# EAGLE design board (EAGLE 6.5.0)
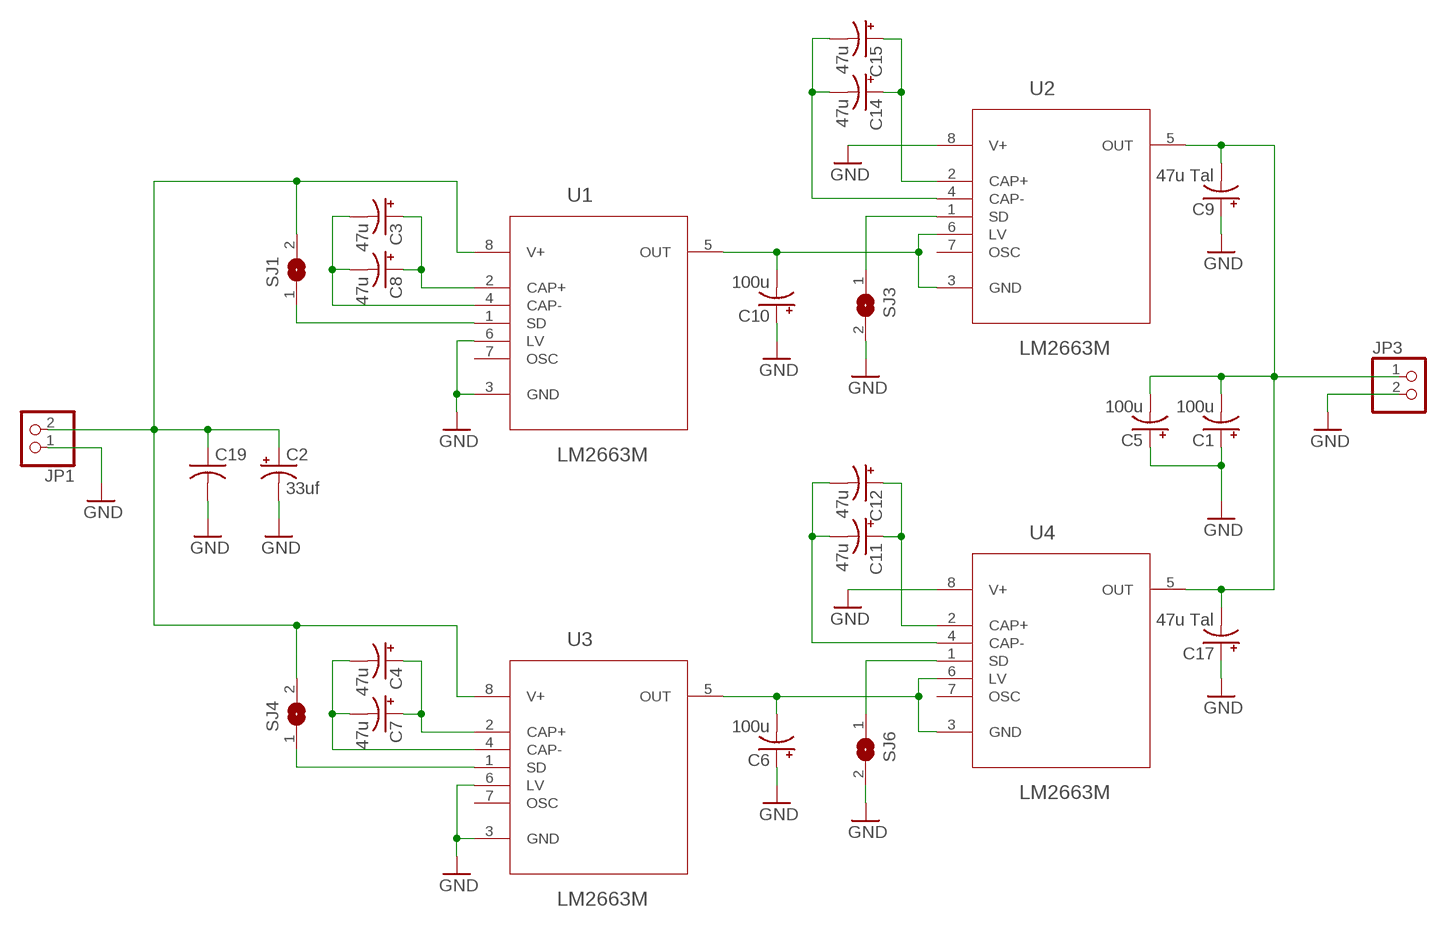
[diagram p0: schematic, sheet 1]

## Parts
C1  100u  CPOL-USE2.5-6  [E2,5-6]
C2  33uf  CPOL-USE2-5  [E2-5]
C3  47u  CAP_POL3528-KIT  [EIA3528-KIT]
C4  47u  CAP_POL3528-KIT  [EIA3528-KIT]
C5  100u  CPOL-USE2.5-6  [E2,5-6]
C6  100u  CAP_POL7343  [EIA7343]
C7  47u  CAP_POL3528-KIT  [EIA3528-KIT]
C8  47u  CAP_POL3528-KIT  [EIA3528-KIT]
C9  47u Tal  CAP_POL6032  [EIA6032]
C10  100u  CAP_POL7343  [EIA7343]
C11  47u  CAP_POL3528-KIT  [EIA3528-KIT]
C12  47u  CAP_POL3528-KIT  [EIA3528-KIT]
C14  47u  CAP_POL3528-KIT  [EIA3528-KIT]
C15  47u  CAP_POL3528-KIT  [EIA3528-KIT]
C17  47u Tal  CAP_POL6032  [EIA6032]
C19  C-USC1206  [C1206]
JP1  PINHD-1X2  [1X02]
JP3  PINHD-1X2  [1X02]
SJ1  SJ  [SJ]
SJ3  SJ  [SJ]
SJ4  SJ  [SJ]
SJ6  SJ  [SJ]
U1  LM2663M  [SOIC127P620X175-8N]
U2  LM2663M  [SOIC127P620X175-8N]
U3  LM2663M  [SOIC127P620X175-8N]
U4  LM2663M  [SOIC127P620X175-8N]

## Nets
GND: C1.+ C2.- C5.+ C6.A(+) C9.P$1(+) C10.A(+) C17.P$1(+) C19.2 JP1.1 JP3.2 SJ3.2 SJ6.2 U1.3(GND) U1.6(LV) U2.8(V+) U3.3(GND) U3.6(LV) U4.8(V+)
N$1: C2.+ C19.1 JP1.2 SJ1.2 SJ4.2 U1.8(V+) U3.8(V+)
N$2: C14.A(+) C15.A(+) U2.2(CAP+)
N$3: SJ1.1 U1.1(SD)
N$4: SJ6.1 U4.1(SD)
N$5: C3.A(+) C8.A(+) U1.2(CAP+)
N$6: C3.C(-) C8.C(-) U1.4(CAP-)
N$7: C10.C(-) U1.5(OUT) U2.3(GND) U2.6(LV)
N$8: C14.C(-) C15.C(-) U2.4(CAP-)
N$9: C1.- C5.- C9.P$2(-) C17.P$2(-) JP3.1 U2.5(OUT) U4.5(OUT)
N$10: SJ3.1 U2.1(SD)
N$11: C4.A(+) C7.A(+) U3.2(CAP+)
N$12: C4.C(-) C7.C(-) U3.4(CAP-)
N$13: C6.C(-) U3.5(OUT) U4.3(GND) U4.6(LV)
N$14: SJ4.1 U3.1(SD)
N$15: C11.A(+) C12.A(+) U4.2(CAP+)
N$16: C11.C(-) C12.C(-) U4.4(CAP-)
Unconnected: U1.7(OSC) U2.7(OSC) U3.7(OSC) U4.7(OSC)

## Library data of the parts
C1 C2 C5 = rcl:CPOL-US: POLARIZED CAPACITOR, American symbol
C3 C4 C6-C12 C14 C15 C17 = SparkFun-Capacitors:CAP_POL: Capacitor Polarized These are standard SMD and PTH capacitors. Normally 10uF, 47uF, and 100uF in electrolytic and tantalum varieties. Always verify the external diameter of the through hole cap, it varies with capacity, voltage, and manufacturer. The EIA devices should be standard.
C19 = rcl:C-US: CAPACITOR, American symbol
JP1 JP3 = pinhead:PINHD-1X2: PIN HEADER
SJ1 SJ3 SJ4 SJ6 = jumper:SJ: SMD solder JUMPER
U1-U4 = lm2663:LM2663M: Voltage Converter; MPN: LM2663M; OC_FARNELL: 1469160; OC_NEWARK: 41K4024; PACKAGE: SOIC-8; SUPPLIER: National Semiconductor

## Board
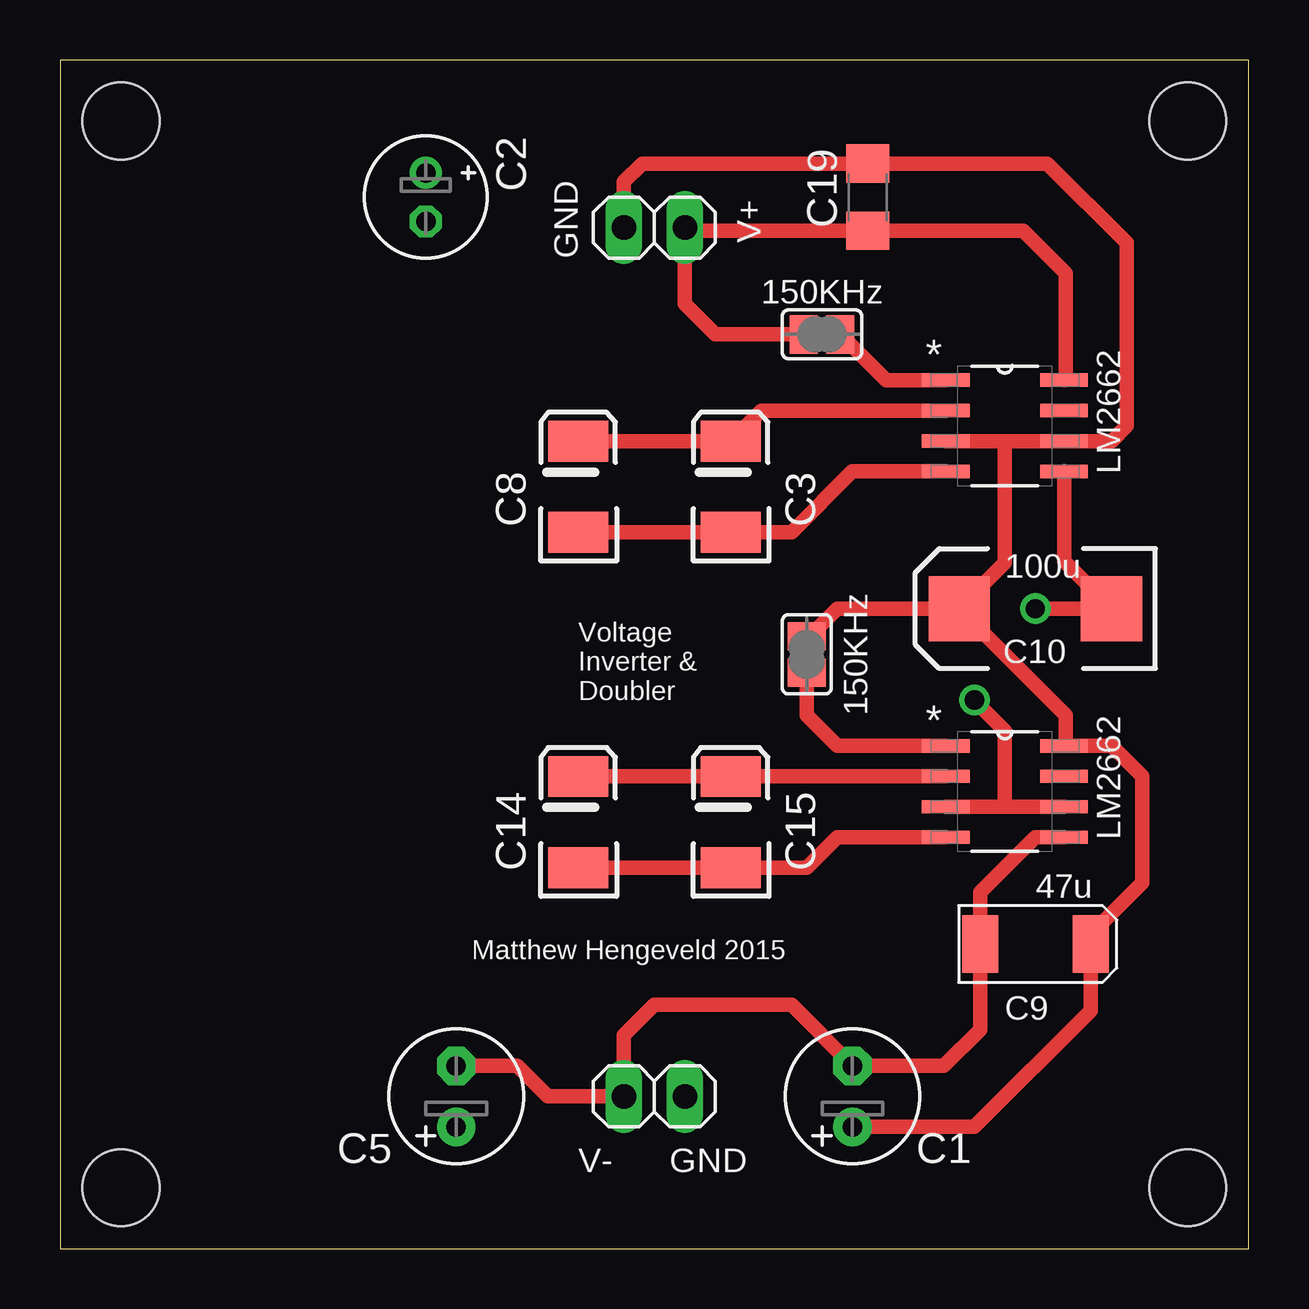
[diagram p1: board, top side]
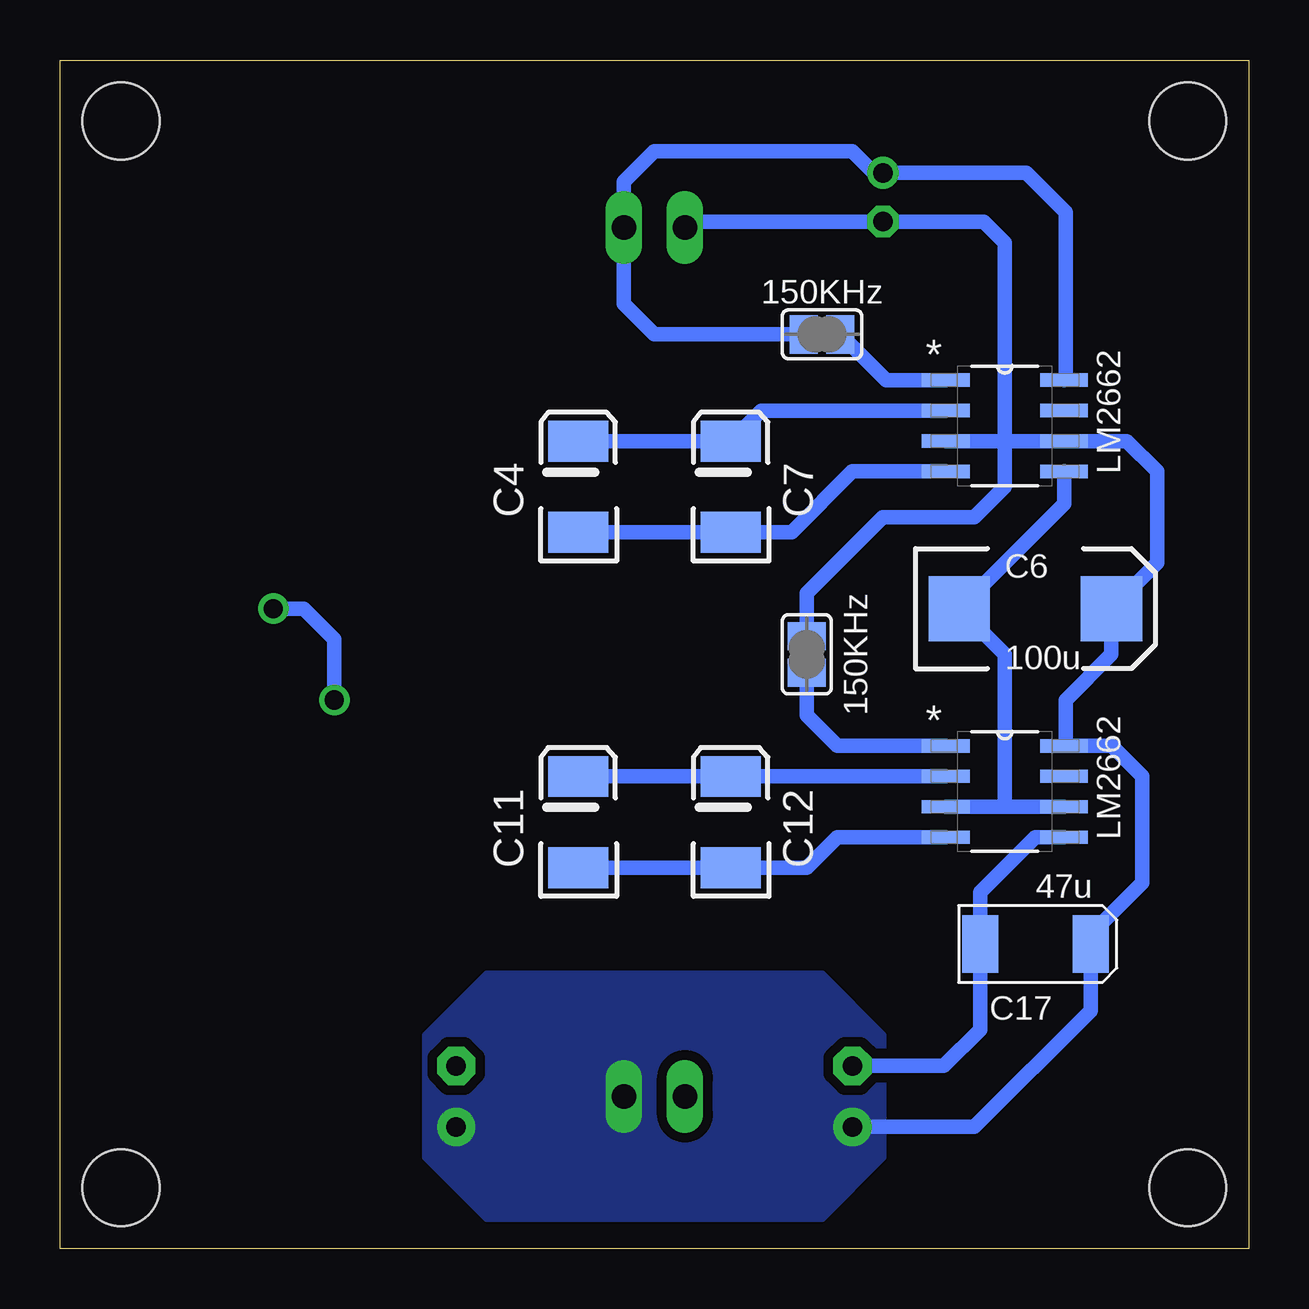
[diagram p2: board, bottom side, seen from below]

Size 49.53 x 49.53 mm. Coordinates in mm from the lower left corner, seen from the top.
Outline: 0,0 49.53,0 49.53,49.53 0,49.53 0,0
Copper layers (1*16): Top 0.035mm / dielectric 1.5mm / Bottom 0.035mm
Design rules "SeeedStudio_2layer_DRU_no_angle_20140221": minimum track width 6mil, minimum drill 12mil, track to track 6mil, track to pad 6mil, pad to pad 6mil, via to via 6mil, smd to smd 0mil, copper to edge 10mil, drill to drill 10mil, minimum pad ring 10mil, minimum via ring 6mil, stop-mask expansion 2mil, vias tented up to drill 100mil, thermal gap 10mil
Holes 3.2 mm at 2.54,46.99 46.99,46.99 46.99,2.54 2.54,2.54

### Footprints (pad centres in the part's own frame; a part is rotated, then mirrored left to right if it is on the bottom)
E2,5-6 = drill 0.813 pad 1.6: + -1.27,0 | drill 0.813 pad 1.6 octagon: - 1.27,0
E2-5 = drill 0.813 pad 1.27: + -1.016,0 | drill 0.813 pad 1.27 octagon: - 1.016,0
EIA3528-KIT = smd 1.7 x 2.5: A 1.9,0; C -1.9,0
EIA7343 = smd 2.55 x 2.7: A 3.17,0; C -3.17,0
EIA6032 = smd 1.5 x 2.4: P$1 -2.3,0; P$2 2.3,0
C1206 = smd 1.6 x 1.8: 1 -1.4,0; 2 1.4,0
1X02 = drill 1.016 long: 1 -1.27,0; 2 1.27,0
SJ = smd 1.168 x 1.6: 1 -0.762,0; 2 0.762,0
SOIC127P620X175-8N = smd 1.981 x 0.559: 1 -2.464,1.905; 2 -2.464,0.635; 3 -2.464,-0.635; 4 -2.464,-1.905; 5 2.464,-1.905; 6 2.464,-0.635; 7 2.464,0.635; 8 2.464,1.905

### Placement (x,y rotation side)
C1  33.02,6.35 90 top
C2  15.24,43.81 270 top
C3  27.94,31.75 90 top
C4  27.94,31.75 90 bottom
C5  16.51,6.35 90 top
C6  8.89,26.67 0 bottom
C7  21.59,31.75 90 bottom
C8  21.59,31.75 90 top
C9  40.64,12.7 180 top
C10  40.64,26.67 180 top
C11  27.94,17.78 90 bottom
C12  21.59,17.78 90 bottom
C14  21.59,17.78 90 top
C15  27.94,17.78 90 top
C17  8.89,12.7 180 bottom
C19  33.66,43.81 90 top
JP1  24.77,42.55 0 top
JP3  24.77,6.35 0 top
SJ1  31.75,38.1 180 top
SJ3  31.11,24.77 90 top
SJ4  17.78,38.1 180 bottom
SJ6  18.41,24.77 90 bottom
U1  39.37,34.29 0 top
U2  39.37,19.05 0 top
U3  10.16,34.29 0 bottom
U4  10.16,19.05 0 bottom

### Tracks (layer width: path | path; a pad name or v marks a point on that pad's centre or on a via)
GND
  Top 0.61: JP1.1 23.5,44.45 24.26,45.22 C19.2 41.15,45.22 44.45,41.91 44.45,34.29 43.81,33.66 U1.6 39.37,33.66 | U1.3 39.37,33.66 | C10.A 39.37,28.57 39.37,33.66 | SJ3.2 31.24,25.53 32.38,26.67 C10.A | C1.+ 38.1,5.08 42.94,9.92 C9.P$1 42.94,13.1 45.09,15.24 45.09,19.68 43.81,20.95 U2.8 41.91,21.03 41.91,22.23 C10.A
  Bottom 0.61: JP1.1 23.24,42.8 C2.- 11.05,42.8 10.16,41.91 10.16,33.66 | 10.16,33.66 U3.6 5.08,33.66 3.81,32.38 3.81,28.57 C6.A 5.72,24.76 7.62,22.86 7.62,21.03 U4.8 5.71,20.95 4.45,19.68 4.45,15.24 6.59,13.1 C17.P$1 6.59,9.92 11.43,5.08 C5.+ | U3.3 10.16,33.66 | SJ6.2 18.41,27.3 15.24,30.48 11.43,30.48 10.16,31.75 10.16,33.66
  pour Bottom (isolate 0.406, no thermals): 31.75,11.43 17.78,11.43 15.24,8.89 15.24,3.81 17.78,1.27 31.75,1.27 34.29,3.81 34.29,8.89
N$1
  Top 0.61: U1.8 41.91,36.27 41.91,40.64 40.13,42.41 C19.1 26.16,42.41 JP1.2 26.04,39.37 27.3,38.1 SJ1.2
  Bottom 0.61: U3.8 7.62,36.27 7.62,43.18 9.27,44.83 C2.+ 15.62,44.83 16.51,45.72 24.77,45.72 26.04,44.45 26.04,43.18 JP1.2 26.04,39.37 24.77,38.1 SJ4.2
N$2
  Top 0.61: U2.2 C15.A C14.A
N$3
  Top 0.61: U1.1 34.42,36.2 SJ1.1
N$4
  Bottom 0.61: U4.1 17.14,20.95 18.41,22.23 SJ6.1
N$5
  Top 0.61: C8.A C3.A 29.21,34.92 U1.2
N$6
  Top 0.61: C8.C C3.C 30.48,29.84 33.02,32.38 U1.4
N$7  (via drill 0.8 pad 1.27)
  Top 0.61: U1.5 41.83,28.65 C10.C v40.64,26.67 | U2.3 39.37,18.41 | 39.37,18.41 U2.6 | v38.1,22.86 39.37,21.59 39.37,18.41
  Bottom 0.61: v38.1,22.86 38.1,25.4 39.37,26.67 v40.64,26.67
N$8
  Top 0.61: U2.4 32.38,17.14 31.11,15.88 C15.C C14.C
N$9
  Top 0.61: U2.5 40.64,17.14 38.34,14.85 C9.P$2 38.34,9.13 36.83,7.62 C1.- 30.48,10.16 24.77,10.16 23.5,8.89 JP3.1 20.32,6.35 19.05,7.62 C5.-
  Bottom 0.61: C5.- 12.7,7.62 11.19,9.13 C17.P$2 11.19,14.85 8.89,17.14 U4.5
N$10
  Top 0.61: SJ3.1 31.11,22.23 32.38,20.95 U2.1
N$11
  Bottom 0.61: U3.2 20.32,34.92 C7.A C4.A
N$12
  Bottom 0.61: C4.C C7.C 19.05,29.84 16.51,32.38 U3.4
N$13
  Bottom 0.61: U3.5 7.7,31.03 C6.C 10.16,24.77 10.16,18.41 | 10.16,18.41 U4.6 | 10.16,18.41 U4.3
N$14
  Bottom 0.61: U3.1 15.11,36.2 SJ4.1
N$15
  Bottom 0.61: U4.2 C12.A C11.A
N$16
  Bottom 0.61: U4.4 17.14,17.14 18.41,15.88 C12.C C11.C

### Text on the board
tPlace: V+ | GND | 150KHz | LM2662 | 100u | Voltage / Inverter & / Doubler | 150KHz | LM2662 | 47u | Matthew Hengeveld 2015 | C9 | V- | GND
bPlace: 150KHz | LM2662 | 100u | LM2662 | 150KHz | 47u | C17